# EAGLE schematic Display (EAGLE 7.4.1)

## Sheet 1 of 2
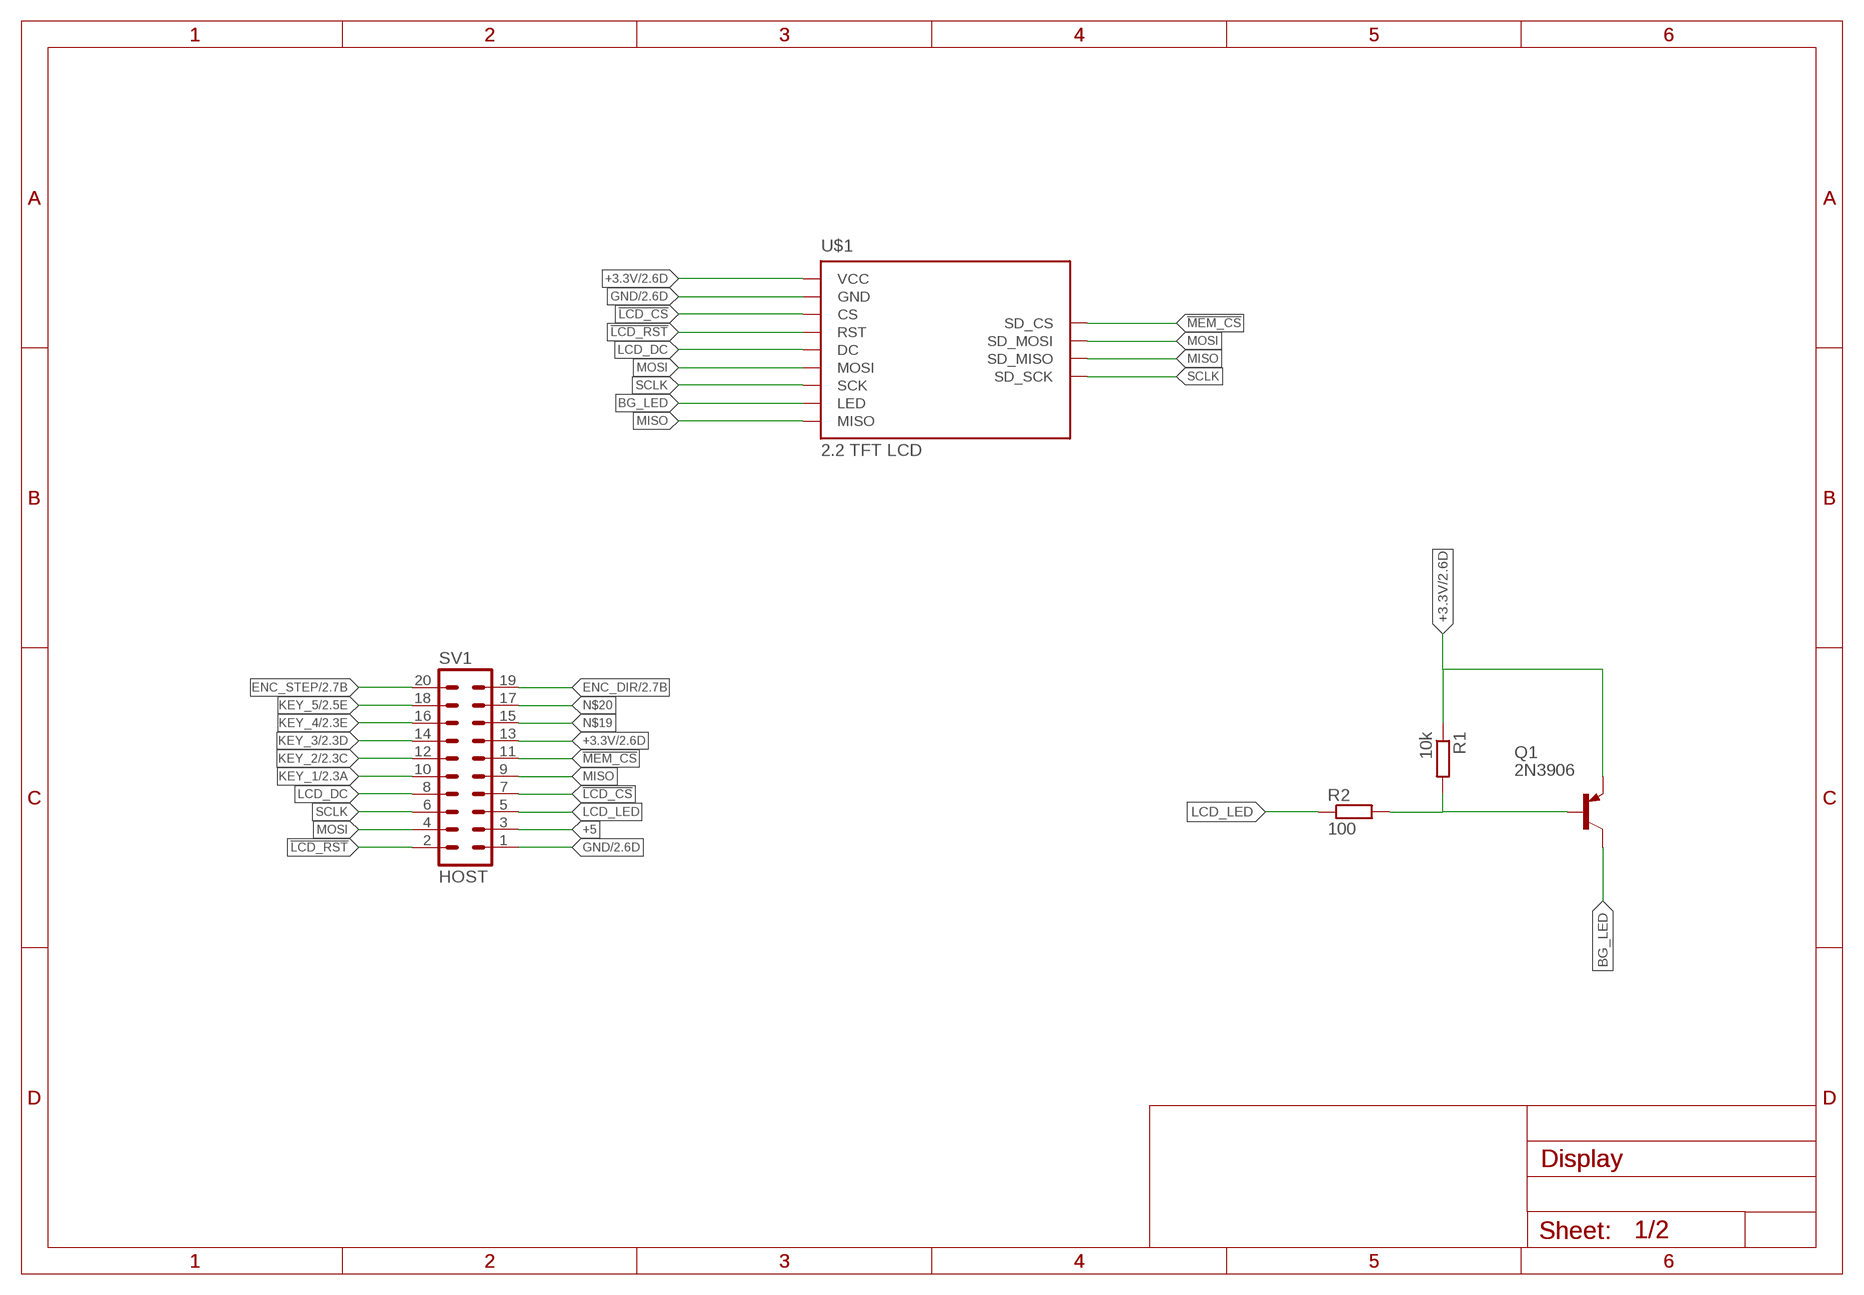
[diagram p0: schematic, sheet 1]

### Parts
Q1  2N3906  [TO92]
R1  10k  R-EU_0204/7  [0204/7]
R2  100  R-EU_0204/7  [0204/7]
SV1  HOST  ML20L  [ML20L]
U$1  2.2_TFT_LCD  [2.2_TFT_LCD]

### Nets
!LCD_CS: SV1.7 U$1.CS
!LCD_RST: SV1.2 U$1.RST
!MEM_CS: SV1.11 U$1.SD_CS
+3.3V: Q1.3(E) R1.1 SV1.13 U$1.VCC ; also sheet 2
+5: SV1.3
BG_LED: Q1.1(C) U$1.LED
ENC_DIR: SV1.19 ; also sheet 2
ENC_STEP: SV1.20 ; also sheet 2
GND: SV1.1 U$1.GND ; also sheet 2
KEY_1: SV1.10 ; also sheet 2
KEY_2: SV1.12 ; also sheet 2
KEY_3: SV1.14 ; also sheet 2
KEY_4: SV1.16 ; also sheet 2
KEY_5: SV1.18 ; also sheet 2
LCD_DC: SV1.8 U$1.DC
LCD_LED: R2.1 SV1.5
MISO: SV1.9 U$1.MISO U$1.SD_MISO
MOSI: SV1.4 U$1.MOSI U$1.SD_MOSI
N$2: Q1.2(B) R1.2 R2.2
N$19: SV1.15
N$20: SV1.17
SCLK: SV1.6 U$1.SCK U$1.SD_SCK

## Sheet 2 of 2: Debouncer Simple RC Schmitt-Trigger debouncer
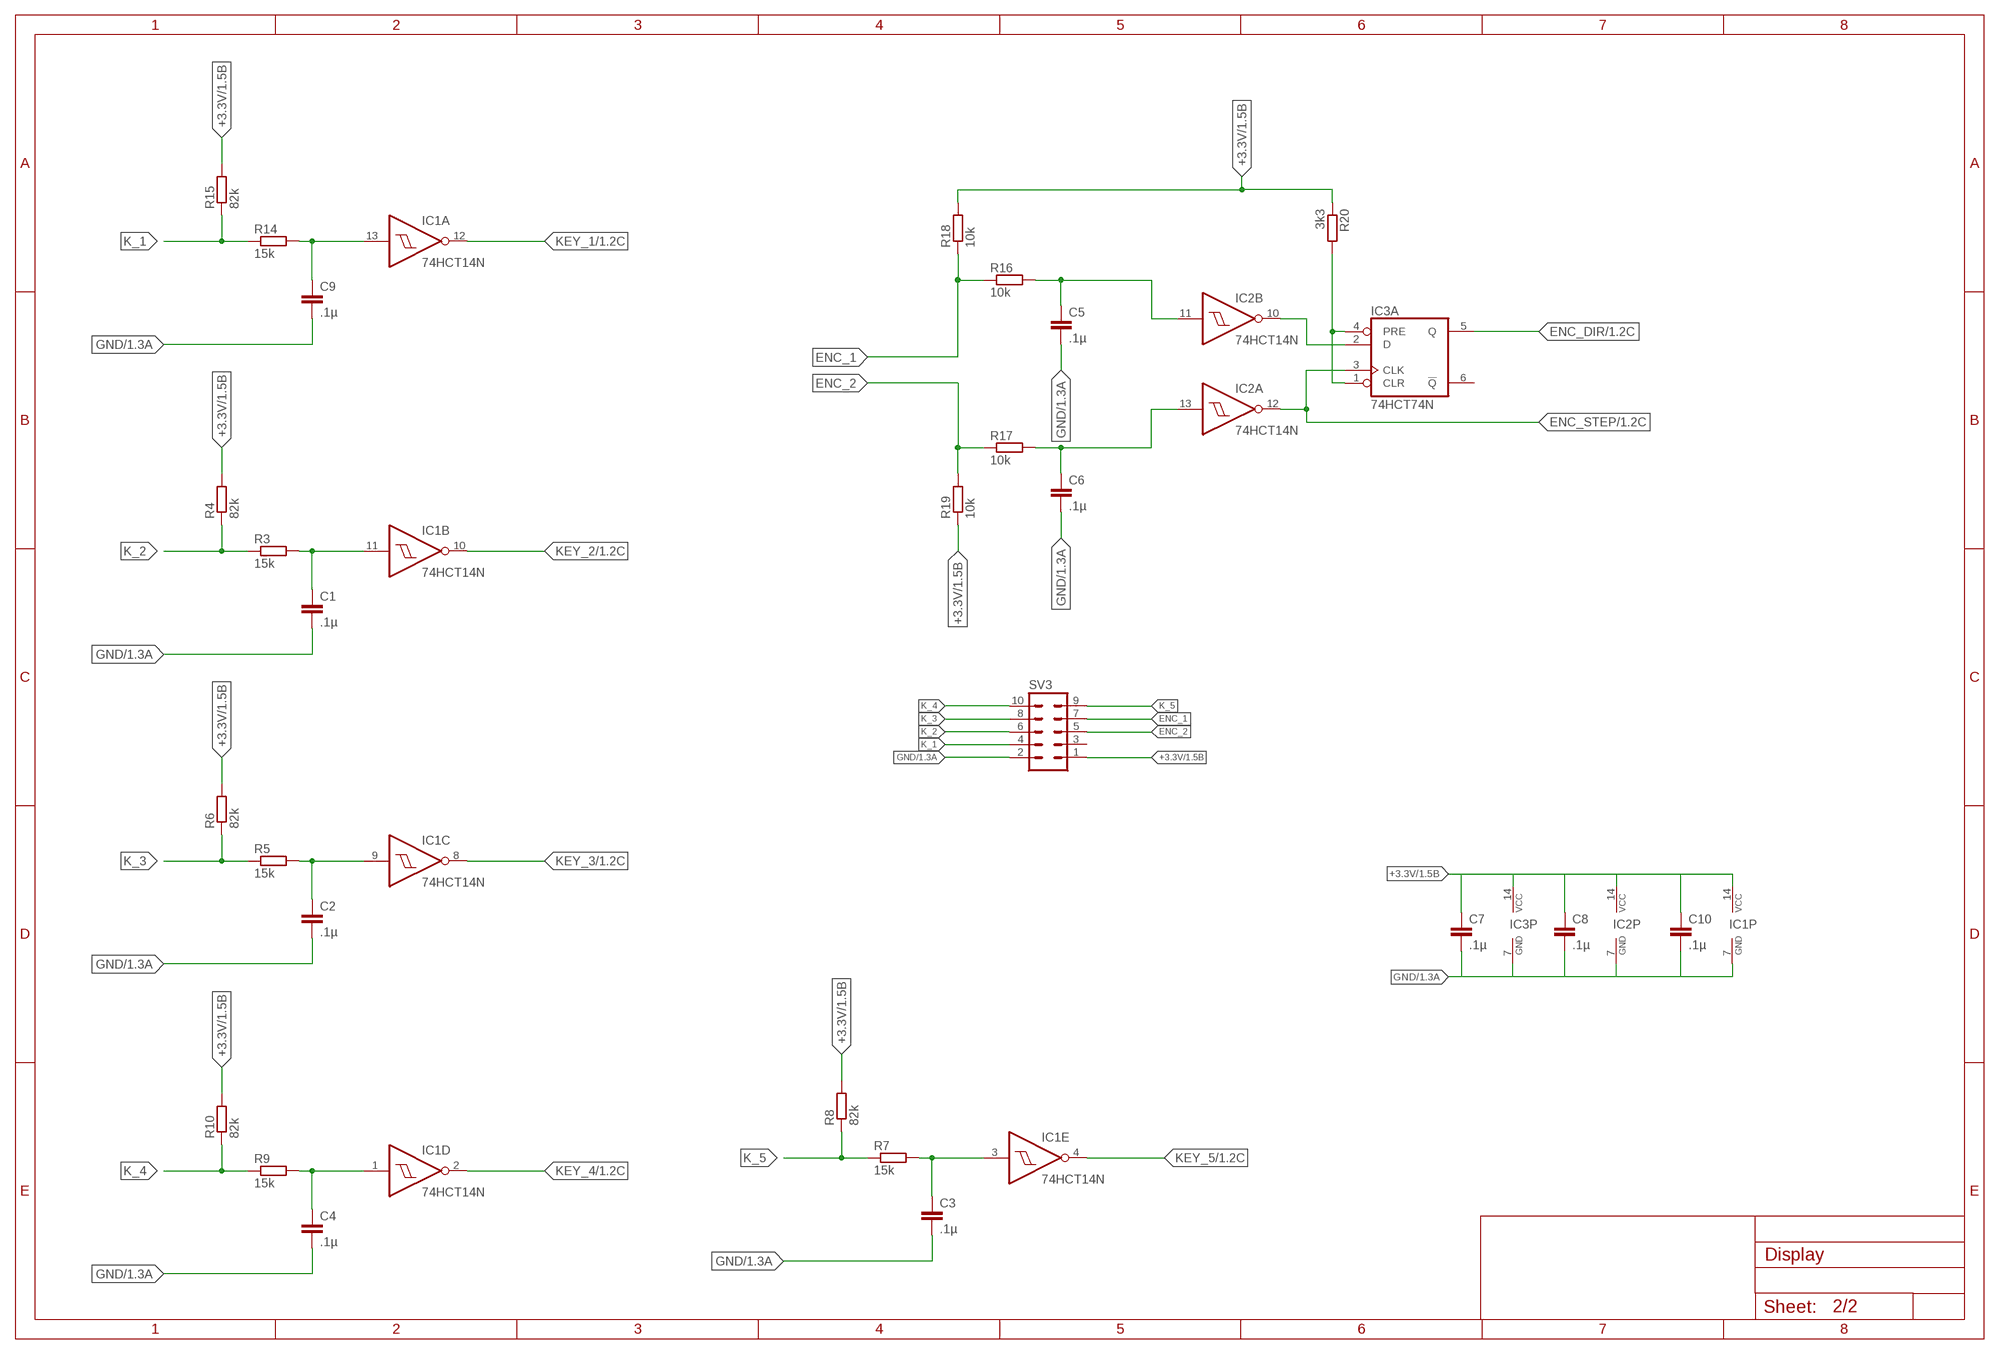
[diagram p1: schematic, sheet 2]

### Parts
C1  .1µ  C-EU025-024X044  [C025-024X044]
C2  .1µ  C-EU025-024X044  [C025-024X044]
C3  .1µ  C-EU025-024X044  [C025-024X044]
C4  .1µ  C-EU025-024X044  [C025-024X044]
C5  .1µ  C-EU025-024X044  [C025-024X044]
C6  .1µ  C-EU025-024X044  [C025-024X044]
C7  .1µ  C-EU025-024X044  [C025-024X044]
C8  .1µ  C-EU025-024X044  [C025-024X044]
C9  .1µ  C-EU025-024X044  [C025-024X044]
C10  .1µ  C-EU025-024X044  [C025-024X044]
IC1  74HCT14N  [DIL14]
IC2  74HCT14N  [DIL14]
IC3  74HCT74N  [DIL14]
R3  15k  R-EU_0204/7  [0204/7]
R4  82k  R-EU_0204/7  [0204/7]
R5  15k  R-EU_0204/7  [0204/7]
R6  82k  R-EU_0204/7  [0204/7]
R7  15k  R-EU_0204/7  [0204/7]
R8  82k  R-EU_0204/7  [0204/7]
R9  15k  R-EU_0204/7  [0204/7]
R10  82k  R-EU_0204/7  [0204/7]
R14  15k  R-EU_0204/7  [0204/7]
R15  82k  R-EU_0204/7  [0204/7]
R16  10k  R-EU_0204/7  [0204/7]
R17  10k  R-EU_0204/7  [0204/7]
R18  10k  R-EU_0204/7  [0204/7]
R19  10k  R-EU_0204/7  [0204/7]
R20  3k3  R-EU_0204/7  [0204/7]
SV3  ML10L  [ML10L]

### Nets
+3.3V: C7.1 C8.1 C10.1 IC1.14(P:VCC) IC2.14(P:VCC) IC3.14(P:VCC) R4.2 R6.2 R8.2 R10.2 R15.2 R18.2 R19.1 R20.1 SV3.1 ; also sheet 1
ENC1: C5.1 IC2.11(B:I) R16.2
ENC2: C6.1 IC2.13(A:I) R17.2
ENC_1: R16.1 R18.1 SV3.7
ENC_2: R17.1 R19.2 SV3.5
ENC_DIR: IC3.5(A:Q) ; also sheet 1
ENC_STEP: IC2.12(A:O) IC3.3(A:CLK) ; also sheet 1
GND: C1.2 C2.2 C3.2 C4.2 C5.2 C6.2 C7.2 C8.2 C9.2 C10.2 IC1.7(P:GND) IC2.7(P:GND) IC3.7(P:GND) SV3.2 ; also sheet 1
K1: C9.1 IC1.13(A:I) R14.2
K2: C1.1 IC1.11(B:I) R3.2
K3: C2.1 IC1.9(C:I) R5.2
K4: C3.1 IC1.3(E:I) R7.2
K5: C4.1 IC1.1(D:I) R9.2
K_1: R14.1 R15.1 SV3.4
K_2: R3.1 R4.1 SV3.6
K_3: R5.1 R6.1 SV3.8
K_4: R9.1 R10.1 SV3.10
K_5: R7.1 R8.1 SV3.9
KEY_1: IC1.12(A:O) ; also sheet 1
KEY_2: IC1.10(B:O) ; also sheet 1
KEY_3: IC1.8(C:O) ; also sheet 1
KEY_4: IC1.2(D:O) ; also sheet 1
KEY_5: IC1.4(E:O) ; also sheet 1
N$1: IC2.10(B:O) IC3.2(A:D)
N$3: IC3.1(A:CLR) IC3.4(A:PRE) R20.2
Unconnected: IC1.5(F:I) IC1.6(F:O) IC2.1(D:I) IC2.2(D:O) IC2.3(E:I) IC2.4(E:O) IC2.5(F:I) IC2.6(F:O) IC2.8(C:O) IC2.9(C:I) IC3.6(A:!Q) IC3.8(B:!Q) IC3.9(B:Q) IC3.10(B:PRE) IC3.11(B:CLK) IC3.12(B:D) IC3.13(B:CLR) SV3.3

## Library data of the parts
C1-C10 = rcl:C-EU: CAPACITOR, European symbol
IC1 IC2 = 74xx-eu:74*14: Hex schmitt trigger INVERTER
IC3 = 74xx-eu:74*74: Dual D type positive edge triggered FLIP FLOP, preset and clear
Q1 = transistor-pnp:2N3906: PNP Transistor
R1-R10 R14-R20 = resistor:R-EU_: RESISTOR, European symbol
SV1 = con-harting-ml:ML20: HARTING; OC_FARNELL: unknown; OC_NEWARK: unknown
SV3 = con-harting-ml:ML10: HARTING; OC_FARNELL: unknown; OC_NEWARK: unknown
U$1 = 2.2"tft:2.2_TFT_LCD

## Net classes
1 Supply: width 0.762 mm